# EasyEDA schematic Sheet_4_Ver2.json
TITLE: Sheet_4; REV: 1.0; Date: 2023-03-09; Sheet: 1/1; Drawn By: venkatakrishnanr; Company: Your Company
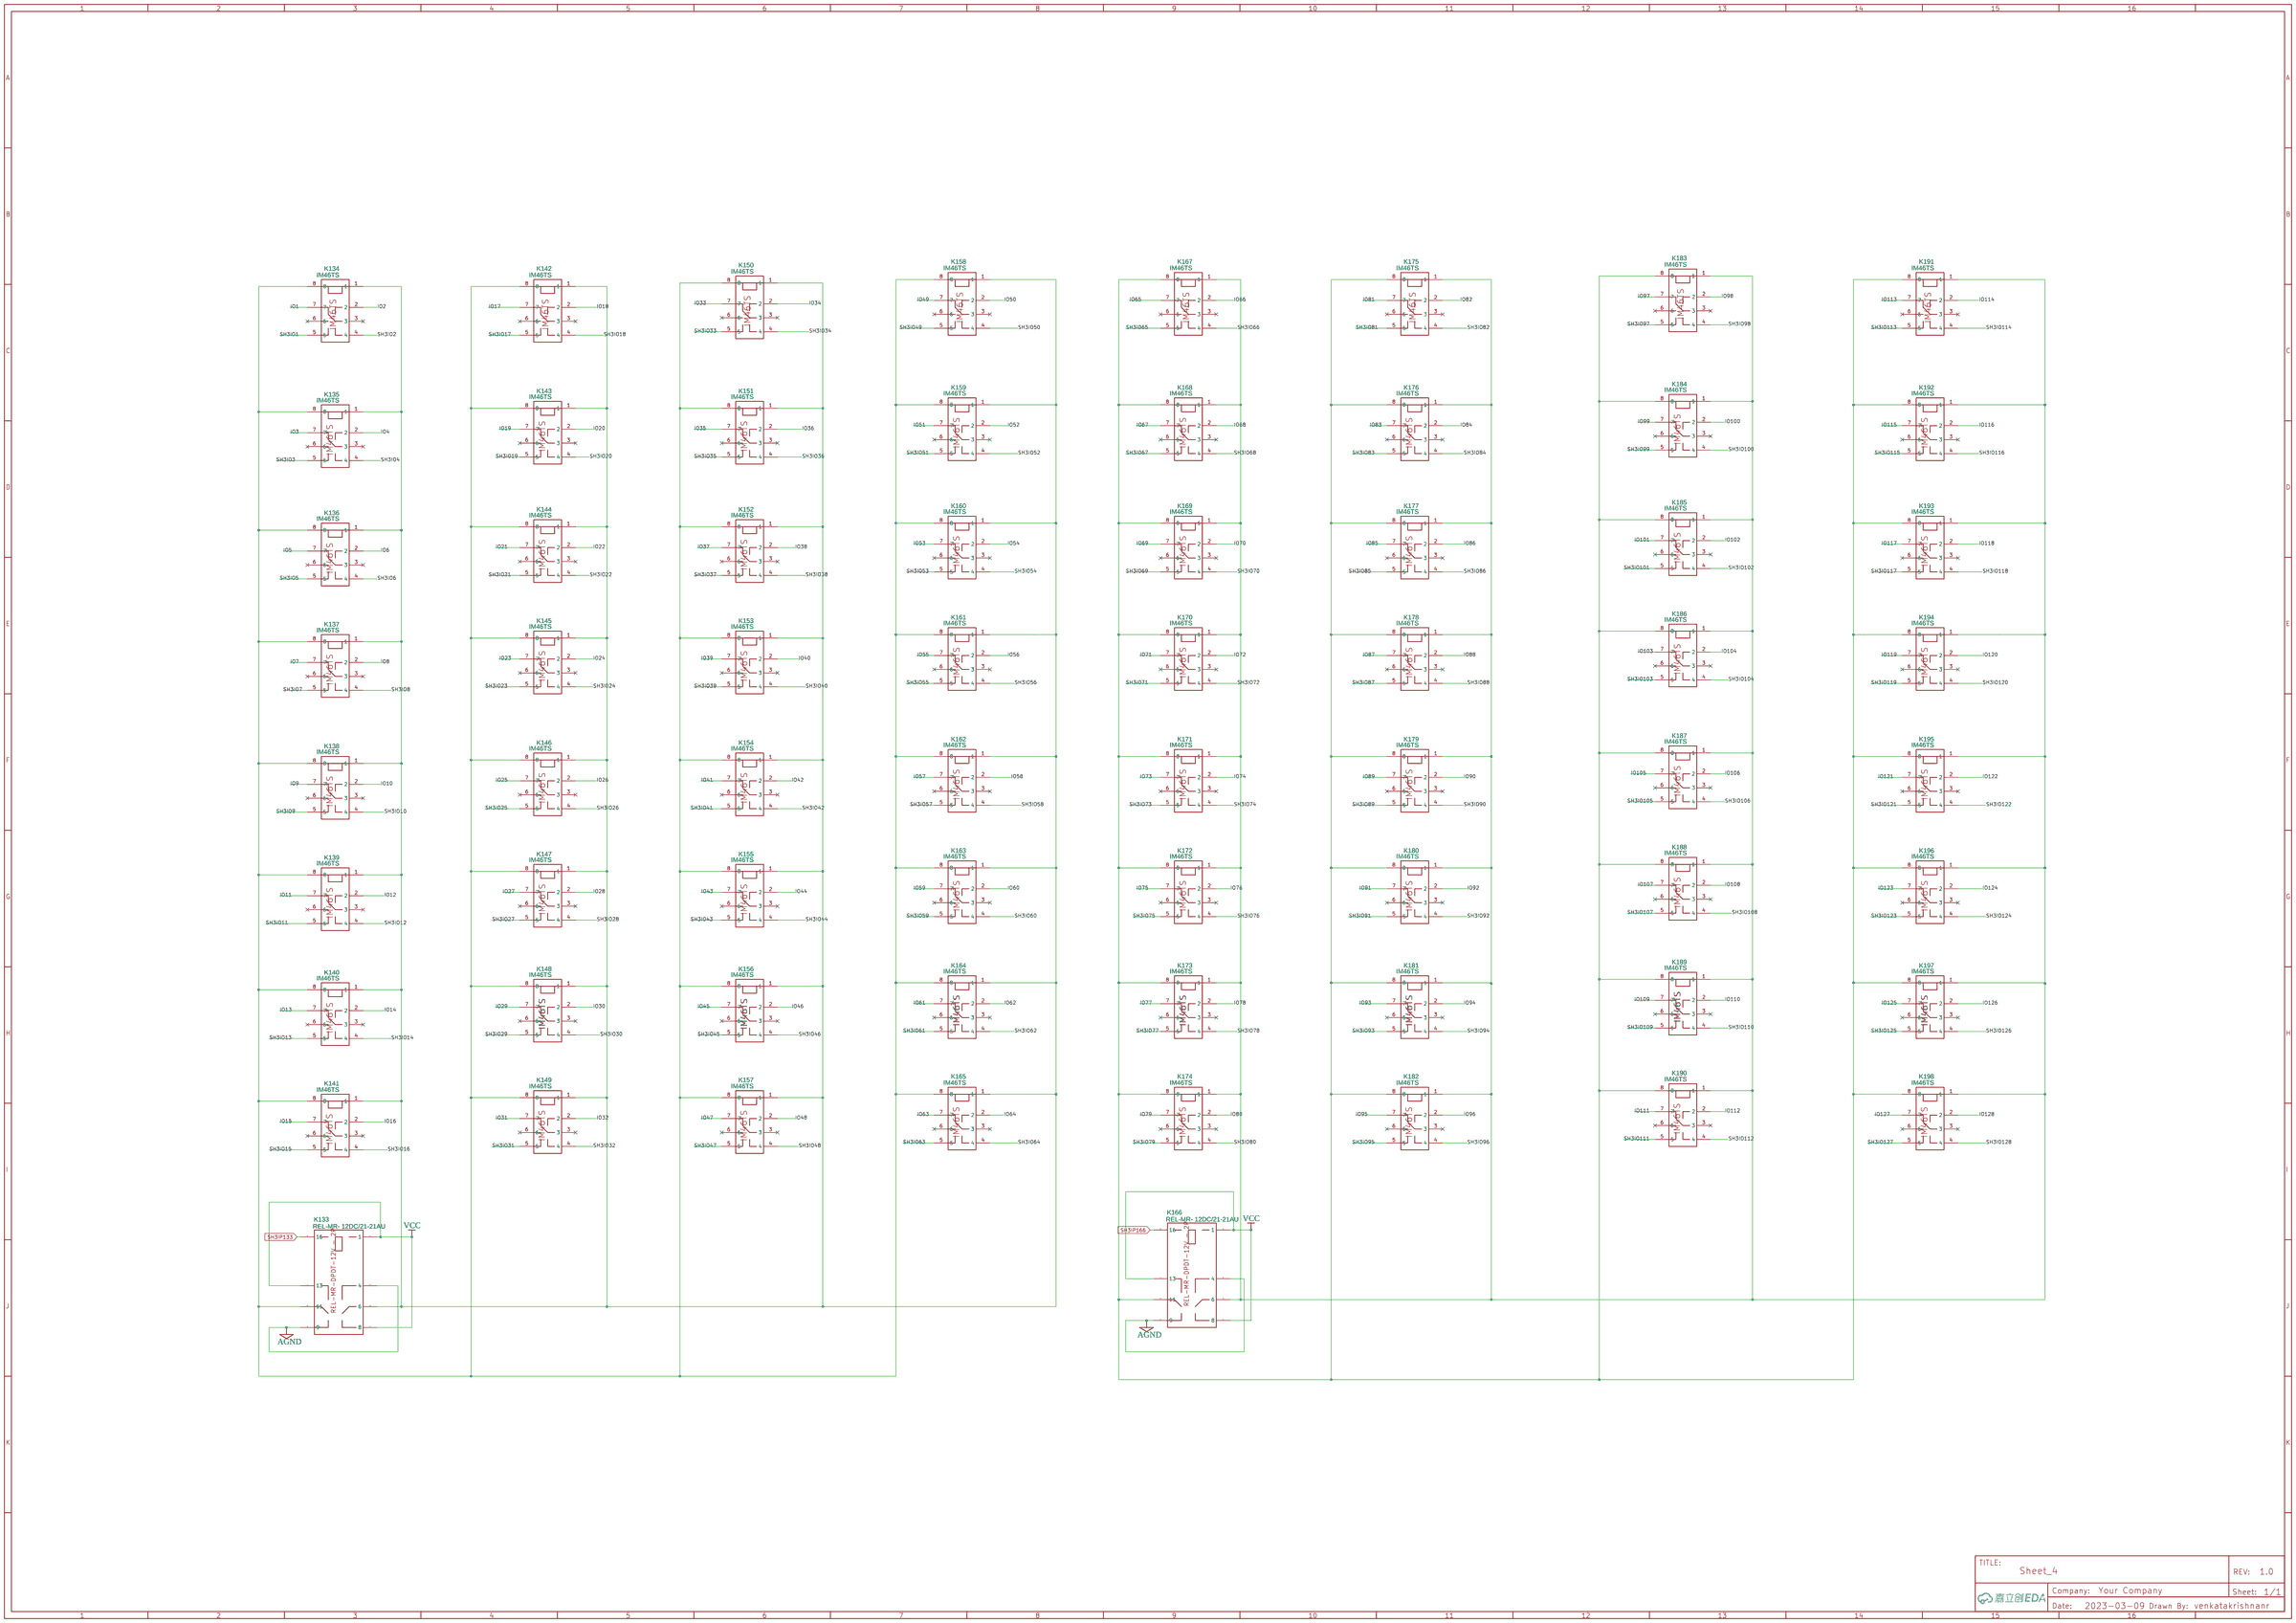
[diagram p0: schematic sheet]

## Parts
K133  REL-MR- 12DC/21-21AU  [REL_MRDPDT_12V_FP]
K134  IM46TS  [SIP_01X08_D0.7MM]
K135  IM46TS  [SIP_01X08_D0.7MM]
K136  IM46TS  [SIP_01X08_D0.7MM]
K137  IM46TS  [SIP_01X08_D0.7MM]
K138  IM46TS  [SIP_01X08_D0.7MM]
K139  IM46TS  [SIP_01X08_D0.7MM]
K140  IM46TS  [SIP_01X08_D0.7MM]
K141  IM46TS  [SIP_01X08_D0.7MM]
K142  IM46TS  [SIP_01X08_D0.7MM]
K143  IM46TS  [SIP_01X08_D0.7MM]
K144  IM46TS  [SIP_01X08_D0.7MM]
K145  IM46TS  [SIP_01X08_D0.7MM]
K146  IM46TS  [SIP_01X08_D0.7MM]
K147  IM46TS  [SIP_01X08_D0.7MM]
K148  IM46TS  [SIP_01X08_D0.7MM]
K149  IM46TS  [SIP_01X08_D0.7MM]
K150  IM46TS  [SIP_01X08_D0.7MM]
K151  IM46TS  [SIP_01X08_D0.7MM]
K152  IM46TS  [SIP_01X08_D0.7MM]
K153  IM46TS  [SIP_01X08_D0.7MM]
K154  IM46TS  [SIP_01X08_D0.7MM]
K155  IM46TS  [SIP_01X08_D0.7MM]
K156  IM46TS  [SIP_01X08_D0.7MM]
K157  IM46TS  [SIP_01X08_D0.7MM]
K158  IM46TS  [SIP_01X08_D0.7MM]
K159  IM46TS  [SIP_01X08_D0.7MM]
K160  IM46TS  [SIP_01X08_D0.7MM]
K161  IM46TS  [SIP_01X08_D0.7MM]
K162  IM46TS  [SIP_01X08_D0.7MM]
K163  IM46TS  [SIP_01X08_D0.7MM]
K164  IM46TS  [SIP_01X08_D0.7MM]
K165  IM46TS  [SIP_01X08_D0.7MM]
K166  REL-MR- 12DC/21-21AU  [REL_MRDPDT_12V_FP]
K167  IM46TS  [SIP_01X08_D0.7MM]
K168  IM46TS  [SIP_01X08_D0.7MM]
K169  IM46TS  [SIP_01X08_D0.7MM]
K170  IM46TS  [SIP_01X08_D0.7MM]
K171  IM46TS  [SIP_01X08_D0.7MM]
K172  IM46TS  [SIP_01X08_D0.7MM]
K173  IM46TS  [SIP_01X08_D0.7MM]
K174  IM46TS  [SIP_01X08_D0.7MM]
K175  IM46TS  [SIP_01X08_D0.7MM]
K176  IM46TS  [SIP_01X08_D0.7MM]
K177  IM46TS  [SIP_01X08_D0.7MM]
K178  IM46TS  [SIP_01X08_D0.7MM]
K179  IM46TS  [SIP_01X08_D0.7MM]
K180  IM46TS  [SIP_01X08_D0.7MM]
K181  IM46TS  [SIP_01X08_D0.7MM]
K182  IM46TS  [SIP_01X08_D0.7MM]
K183  IM46TS  [SIP_01X08_D0.7MM]
K184  IM46TS  [SIP_01X08_D0.7MM]
K185  IM46TS  [SIP_01X08_D0.7MM]
K186  IM46TS  [SIP_01X08_D0.7MM]
K187  IM46TS  [SIP_01X08_D0.7MM]
K188  IM46TS  [SIP_01X08_D0.7MM]
K189  IM46TS  [SIP_01X08_D0.7MM]
K190  IM46TS  [SIP_01X08_D0.7MM]
K191  IM46TS  [SIP_01X08_D0.7MM]
K192  IM46TS  [SIP_01X08_D0.7MM]
K193  IM46TS  [SIP_01X08_D0.7MM]
K194  IM46TS  [SIP_01X08_D0.7MM]
K195  IM46TS  [SIP_01X08_D0.7MM]
K196  IM46TS  [SIP_01X08_D0.7MM]
K197  IM46TS  [SIP_01X08_D0.7MM]
K198  IM46TS  [SIP_01X08_D0.7MM]

## Library data of the parts
K133 K166 = REL-MR- 12DC/21-21AU: Manufacturer: Phoenix Contact; Manufacturer Part: 2961299; Supplier: Digi-Key; Supplier Part: 277-7568-ND; link: https://www.digikey.in/en/products/detail/phoenix-contact/2961299/3596906?s=N4IgTCBcDaIEoFEAyBaAsnFACAjGAIgMID0YOKZAggKogC6AvkA; Contributor: venkatakrishnanr
K134-K165 K167-K198 = IM46TS: Manufacturer: TE Connectivity Potter & Brumfield Relays; Manufacturer Part: 6-1462037-6; Supplier: Digi-Key; Supplier Part: PB2085-ND; link: https://www.digikey.in/en/products/detail/te-connectivity-potter-brumfield-relays/6-1462037-6/2398972?s=N4IgTCBcDaIJYFsAsA2ALgZxAXQL5A; Contributor: venkatakrishnanr

## Nets
AGND: K133.2(4) K133.5(9) K166.2(4) K166.5(9)
VCC: K133.1 K133.4(8) K133.7(13) K166.1 K166.4(8) K166.7(13)
IO1: K134.7
IO2: K134.2
IO3: K135.7
IO4: K135.2
IO5: K136.7
IO6: K136.2
IO7: K137.7
IO8: K137.2
IO9: K138.7
IO10: K138.2
IO11: K139.7
IO12: K139.2
IO13: K140.7
IO14: K140.2
IO15: K141.7
IO16: K141.2
IO17: K142.7
IO18: K142.2
IO19: K143.7
IO20: K143.2
IO21: K144.7
IO22: K144.2
IO23: K145.7
IO24: K145.2
IO25: K146.7
IO26: K146.2
IO27: K147.7
IO28: K147.2
IO29: K148.7
IO30: K148.2
IO31: K149.7
IO32: K149.2
IO33: K150.7
IO34: K150.2
IO35: K151.7
IO36: K151.2
IO37: K152.7
IO38: K152.2
IO39: K153.7
IO40: K153.2
IO41: K154.7
IO42: K154.2
IO43: K155.7
IO44: K155.2
IO45: K156.7
IO46: K156.2
IO47: K157.7
IO48: K157.2
IO49: K158.7
IO50: K158.2
IO51: K159.7
IO52: K159.2
IO53: K160.7
IO54: K160.2
IO55: K161.7
IO56: K161.2
IO57: K162.7
IO58: K162.2
IO59: K163.7
IO60: K163.2
IO61: K164.7
IO62: K164.2
IO63: K165.7
IO64: K165.2
IO65: K167.7
IO66: K167.2
IO67: K168.7
IO68: K168.2
IO69: K169.7
IO70: K169.2
IO71: K170.7
IO72: K170.2
IO73: K171.7
IO74: K171.2
IO75: K172.7
IO76: K172.2
IO77: K173.7
IO78: K173.2
IO79: K174.7
IO80: K174.2
IO81: K175.7
IO82: K175.2
IO83: K176.7
IO84: K176.2
IO85: K177.7
IO86: K177.2
IO87: K178.7
IO88: K178.2
IO89: K179.7
IO90: K179.2
IO91: K180.7
IO92: K180.2
IO93: K181.7
IO94: K181.2
IO95: K182.7
IO96: K182.2
IO97: K183.7
IO98: K183.2
IO99: K184.7
IO100: K184.2
IO101: K185.7
IO102: K185.2
IO103: K186.7
IO104: K186.2
IO105: K187.7
IO106: K187.2
IO107: K188.7
IO108: K188.2
IO109: K189.7
IO110: K189.2
IO111: K190.7
IO112: K190.2
IO113: K191.7
IO114: K191.2
IO115: K192.7
IO116: K192.2
IO117: K193.7
IO118: K193.2
IO119: K194.7
IO120: K194.2
IO121: K195.7
IO122: K195.2
IO123: K196.7
IO124: K196.2
IO125: K197.7
IO126: K197.2
IO127: K198.7
IO128: K198.2
SH3IO1: K134.5
SH3IO2: K134.4
SH3IO3: K135.5
SH3IO4: K135.4
SH3IO5: K136.5
SH3IO6: K136.4
SH3IO7: K137.5
SH3IO8: K137.4
SH3IO9: K138.5
SH3IO10: K138.4
SH3IO11: K139.5
SH3IO12: K139.4
SH3IO13: K140.5
SH3IO14: K140.4
SH3IO15: K141.5
SH3IO16: K141.4
SH3IO17: K142.5
SH3IO18: K142.4
SH3IO19: K143.5
SH3IO20: K143.4
SH3IO21: K144.5
SH3IO22: K144.4
SH3IO23: K145.5
SH3IO24: K145.4
SH3IO25: K146.5
SH3IO26: K146.4
SH3IO27: K147.5
SH3IO28: K147.4
SH3IO29: K148.5
SH3IO30: K148.4
SH3IO31: K149.5
SH3IO32: K149.4
SH3IO33: K150.5
SH3IO34: K150.4
SH3IO35: K151.5
SH3IO36: K151.4
SH3IO37: K152.5
SH3IO38: K152.4
SH3IO39: K153.5
SH3IO40: K153.4
SH3IO41: K154.5
SH3IO42: K154.4
SH3IO43: K155.5
SH3IO44: K155.4
SH3IO45: K156.5
SH3IO46: K156.4
SH3IO47: K157.5
SH3IO48: K157.4
SH3IO49: K158.5
SH3IO50: K158.4
SH3IO51: K159.5
SH3IO52: K159.4
SH3IO53: K160.5
SH3IO54: K160.4
SH3IO55: K161.5
SH3IO56: K161.4
SH3IO57: K162.5
SH3IO58: K162.4
SH3IO59: K163.5
SH3IO60: K163.4
SH3IO61: K164.5
SH3IO62: K164.4
SH3IO63: K165.5
SH3IO64: K165.4
SH3IO65: K167.5
SH3IO66: K167.4
SH3IO67: K168.5
SH3IO68: K168.4
SH3IO69: K169.5
SH3IO70: K169.4
SH3IO71: K170.5
SH3IO72: K170.4
SH3IO73: K171.5
SH3IO74: K171.4
SH3IO75: K172.5
SH3IO76: K172.4
SH3IO77: K173.5
SH3IO78: K173.4
SH3IO79: K174.5
SH3IO80: K174.4
SH3IO81: K175.5
SH3IO82: K175.4
SH3IO83: K176.5
SH3IO84: K176.4
SH3IO85: K177.5
SH3IO86: K177.4
SH3IO87: K178.5
SH3IO88: K178.4
SH3IO89: K179.5
SH3IO90: K179.4
SH3IO91: K180.5
SH3IO92: K180.4
SH3IO93: K181.5
SH3IO94: K181.4
SH3IO95: K182.5
SH3IO96: K182.4
SH3IO97: K183.5
SH3IO98: K183.4
SH3IO99: K184.5
SH3IO100: K184.4
SH3IO101: K185.5
SH3IO102: K185.4
SH3IO103: K186.5
SH3IO104: K186.4
SH3IO105: K187.5
SH3IO106: K187.4
SH3IO107: K188.5
SH3IO108: K188.4
SH3IO109: K189.5
SH3IO110: K189.4
SH3IO111: K190.5
SH3IO112: K190.4
SH3IO113: K191.5
SH3IO114: K191.4
SH3IO115: K192.5
SH3IO116: K192.4
SH3IO117: K193.5
SH3IO118: K193.4
SH3IO119: K194.5
SH3IO120: K194.4
SH3IO121: K195.5
SH3IO122: K195.4
SH3IO123: K196.5
SH3IO124: K196.4
SH3IO125: K197.5
SH3IO126: K197.4
SH3IO127: K198.5
SH3IO128: K198.4
SH3IP133: K133.8(16)
SH3IP166: K166.8(16)
Net-(K133-3): K133.3(6) K134.1 K135.1 K136.1 K137.1 K138.1 K139.1 K140.1 K141.1 K142.1 K143.1 K144.1 K145.1 K146.1 K147.1 K148.1 K149.1 K150.1 K151.1 K152.1 K153.1 K154.1 K155.1 K156.1 K157.1 K158.1 K159.1 K160.1 K161.1 K162.1 K163.1 K164.1 K165.1
Net-(K133-6): K133.6(11) K134.8 K135.8 K136.8 K137.8 K138.8 K139.8 K140.8 K141.8 K142.8 K143.8 K144.8 K145.8 K146.8 K147.8 K148.8 K149.8 K150.8 K151.8 K152.8 K153.8 K154.8 K155.8 K156.8 K157.8 K158.8 K159.8 K160.8 K161.8 K162.8 K163.8 K164.8 K165.8
Net-(K166-3): K166.3(6) K167.1 K168.1 K169.1 K170.1 K171.1 K172.1 K173.1 K174.1 K175.1 K176.1 K177.1 K178.1 K179.1 K180.1 K181.1 K182.1 K183.1 K184.1 K185.1 K186.1 K187.1 K188.1 K189.1 K190.1 K191.1 K192.1 K193.1 K194.1 K195.1 K196.1 K197.1 K198.1
Net-(K166-6): K166.6(11) K167.8 K168.8 K169.8 K170.8 K171.8 K172.8 K173.8 K174.8 K175.8 K176.8 K177.8 K178.8 K179.8 K180.8 K181.8 K182.8 K183.8 K184.8 K185.8 K186.8 K187.8 K188.8 K189.8 K190.8 K191.8 K192.8 K193.8 K194.8 K195.8 K196.8 K197.8 K198.8

Not connected (* = marked no-connect by the designer): K134 3* 6*; K135 3* 6*; K136 3* 6*; K137 3* 6*; K138 3* 6*; K139 3* 6*; K140 3* 6*; K141 3* 6*; K142 3* 6*; K143 3* 6*; K144 3* 6*; K145 3* 6*; K146 3* 6*; K147 3* 6*; K148 3* 6*; K149 3* 6*; K150 3* 6*; K151 3* 6*; K152 3* 6*; K153 3* 6*; K154 3* 6*; K155 3* 6*; K156 3* 6*; K157 3* 6*; K158 3* 6*; K159 3* 6*; K160 3* 6*; K161 3* 6*; K162 3* 6*; K163 3* 6*; K164 3* 6*; K165 3* 6*; K167 3* 6*; K168 3* 6*; K169 3* 6*; K170 3* 6*; K171 3* 6*; K172 3* 6*; K173 3* 6*; K174 3* 6*; K175 3* 6*; K176 3* 6*; K177 3* 6*; K178 3* 6*; K179 3* 6*; K180 3* 6*; K181 3* 6*; K182 3* 6*; K183 3* 6*; K184 3* 6*; K185 3* 6*; K186 3* 6*; K187 3* 6*; K188 3* 6*; K189 3* 6*; K190 3* 6*; K191 3* 6*; K192 3* 6*; K193 3* 6*; K194 3* 6*; K195 3* 6*; K196 3* 6*; K197 3* 6*; K198 3* 6*

## Notes on the sheet
- IM46TS
- IM46TS
- IM46TS
- IM46TS
- IM46TS
- IM46TS
- IM46TS
